# Altium schematic sheet CON_SODIMM_200PIN_MO-224.SchDoc: SODIMM 200Pin
size A4
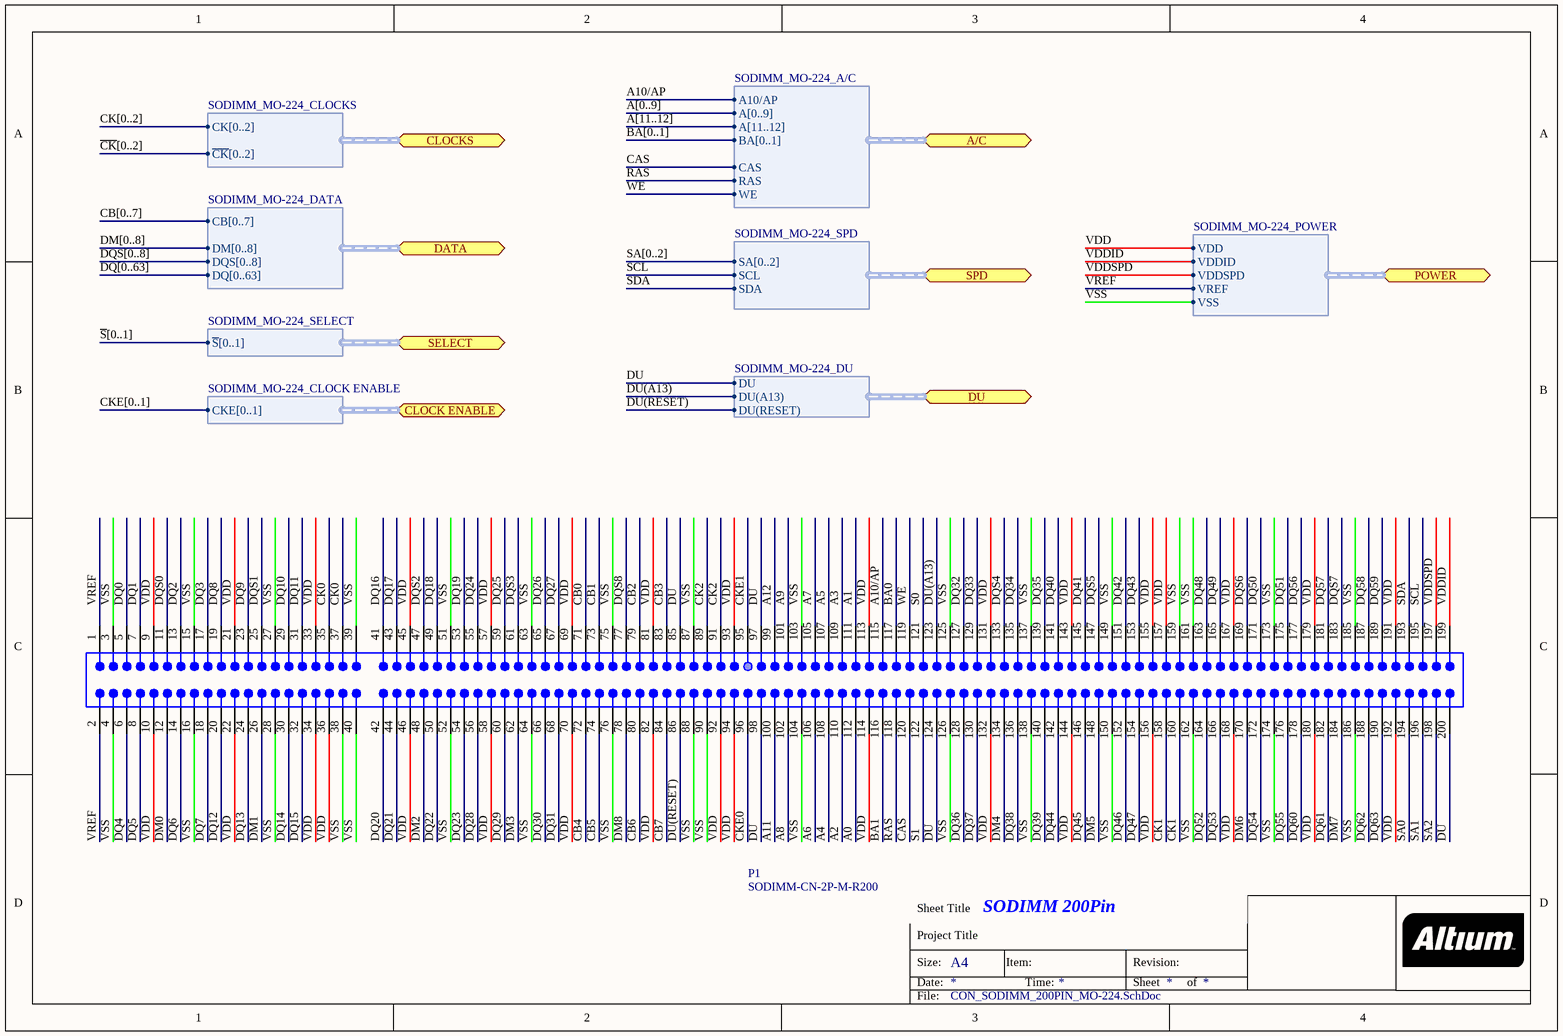
[diagram p0: CON_SODIMM_200PIN_MO-224.SchDoc]

## Parts
P1  SODIMM-CN-2P-M-R200  [SODIMM-GF-2D-600-1K-S200]  (no BOM)

## Ports
A/C (harness SODIMM_MO-224_A/C), CLOCK ENABLE (harness SODIMM_MO-224_CLOCK ENABLE), CLOCKS (harness SODIMM_MO-224_CLOCKS), DATA (harness SODIMM_MO-224_DATA), DU (harness SODIMM_MO-224_DU), POWER (harness SODIMM_MO-224_POWER), SELECT (harness SODIMM_MO-224_SELECT), SPD (harness SODIMM_MO-224_SPD)

## Harnesses
SODIMM_MO-224_CLOCKS: CK[0..2], ~{CK}[0..2]
SODIMM_MO-224_DATA: CB[0..7], DM[0..8], DQS[0..8], DQ[0..63]
SODIMM_MO-224_SELECT: ~{S}[0..1]
SODIMM_MO-224_CLOCK ENABLE: CKE[0..1]
SODIMM_MO-224_A/C: A10/AP, A[0..9], A[11..12], BA[0..1], CAS, RAS, WE
SODIMM_MO-224_SPD: SA[0..2], SCL, SDA
SODIMM_MO-224_DU: DU, DU(A13), DU(RESET)
SODIMM_MO-224_POWER: VDD, VDDID, VDDSPD, VREF, VSS

## Nets
A0: P1.112
A1: P1.111
A2: P1.110
A3: P1.109
A4: P1.108
A5: P1.107
A6: P1.106
A7: P1.105
A8: P1.102
A9: P1.101
A10/AP: P1.115 ; port A/C.A10/AP
A11: P1.100
A12: P1.99
BA0: P1.117
BA1: P1.116
~{CK}0: P1.37
~{CK}1: P1.158
~{CK}2: P1.91
CAS: P1.120 ; port A/C.CAS
CB0: P1.71
CB1: P1.73
CB2: P1.79
CB3: P1.83
CB4: P1.72
CB5: P1.74
CB6: P1.80
CB7: P1.84
CK0: P1.35
CK1: P1.160
CK2: P1.89
CKE0: P1.96
CKE1: P1.95
DM0: P1.12
DM1: P1.26
DM2: P1.48
DM3: P1.62
DM4: P1.134
DM5: P1.148
DM6: P1.170
DM7: P1.184
DM8: P1.78
DQ0: P1.5
DQ1: P1.7
DQ2: P1.13
DQ3: P1.17
DQ4: P1.6
DQ5: P1.8
DQ6: P1.14
DQ7: P1.18
DQ8: P1.19
DQ9: P1.23
DQ10: P1.29
DQ11: P1.31
DQ12: P1.20
DQ13: P1.24
DQ14: P1.30
DQ15: P1.32
DQ16: P1.41
DQ17: P1.43
DQ18: P1.49
DQ19: P1.53
DQ20: P1.42
DQ21: P1.44
DQ22: P1.50
DQ23: P1.54
DQ24: P1.55
DQ25: P1.59
DQ26: P1.65
DQ27: P1.67
DQ28: P1.56
DQ29: P1.60
DQ30: P1.66
DQ31: P1.68
DQ32: P1.127
DQ33: P1.129
DQ34: P1.135
DQ35: P1.139
DQ36: P1.128
DQ37: P1.130
DQ38: P1.136
DQ39: P1.140
DQ40: P1.141
DQ41: P1.145
DQ42: P1.151
DQ43: P1.153
DQ44: P1.142
DQ45: P1.146
DQ46: P1.152
DQ47: P1.154
DQ48: P1.163
DQ49: P1.165
DQ50: P1.171
DQ51: P1.175
DQ52: P1.164
DQ53: P1.166
DQ54: P1.172
DQ55: P1.176
DQ56: P1.177
DQ57: P1.181
DQ58: P1.187
DQ59: P1.189
DQ60: P1.178
DQ61: P1.182
DQ62: P1.188
DQ63: P1.190
DQS0: P1.11
DQS1: P1.25
DQS2: P1.47
DQS3: P1.61
DQS4: P1.133
DQS5: P1.147
DQS6: P1.169
DQS7: P1.183
DQS8: P1.77
DU: P1.85 P1.97 P1.98 P1.124 P1.200 ; port DU.DU
DU(A13): P1.123 ; port DU.DU(A13)
DU(RESET): P1.86 ; port DU.DU(RESET)
RAS: P1.118 ; port A/C.RAS
~{S}0: P1.121
~{S}1: P1.122
SA0: P1.194
SA1: P1.196
SA2: P1.198
SCL: P1.195 ; port SPD.SCL
SDA: P1.193 ; port SPD.SDA
VDD: P1.9 P1.10 P1.21 P1.22 P1.33 P1.34 P1.36 P1.45 P1.46 P1.57 P1.58 P1.69 P1.70 P1.81 P1.82 P1.92 P1.93 P1.94 P1.113 P1.114 P1.131 P1.132 P1.143 P1.144 P1.155 P1.156 P1.157 P1.167 P1.168 P1.179 P1.180 P1.191 P1.192 ; port POWER.VDD
VDDID: P1.199 ; port POWER.VDDID
VDDSPD: P1.197 ; port POWER.VDDSPD
VREF: P1.1 P1.2 ; port POWER.VREF
VSS: P1.3 P1.4 P1.15 P1.16 P1.27 P1.28 P1.38 P1.39 P1.40 P1.51 P1.52 P1.63 P1.64 P1.75 P1.76 P1.87 P1.88 P1.90 P1.103 P1.104 P1.125 P1.126 P1.137 P1.138 P1.149 P1.150 P1.159 P1.161 P1.162 P1.173 P1.174 P1.185 P1.186 ; port POWER.VSS
WE: P1.119 ; port A/C.WE

## Buses and harness runs
bus A[0..9]
bus A[11..12]
bus BA[0..1]
bus CB[0..7]
bus CK[0..2]
bus CKE[0..1]
bus DM[0..8]
bus DQ[0..63]
bus DQS[0..8]
bus SA[0..2]
bus ~{CK}[0..2]
bus ~{S}[0..1]

## Notes on the sheet
- Sheet Title
- Project Title
- Size:
- Date:
- A4
- Item:
- Time:
- Revision:
- Sheet
- of
- File:

## Library data of the parts
P1 = CMP-0001-00060-2: Golden finger, SODIMM, Dual, Staggered, Pitch 0.6mm, 200-Position; Mating Connector: Tyco-6-1473005-1; Publisher: Altium; ClassName: Edge Connector; Package Reference: SODIMM-GF-2D-600-1K-S200